# EAGLE design light_brick (EAGLE 7.2.0)
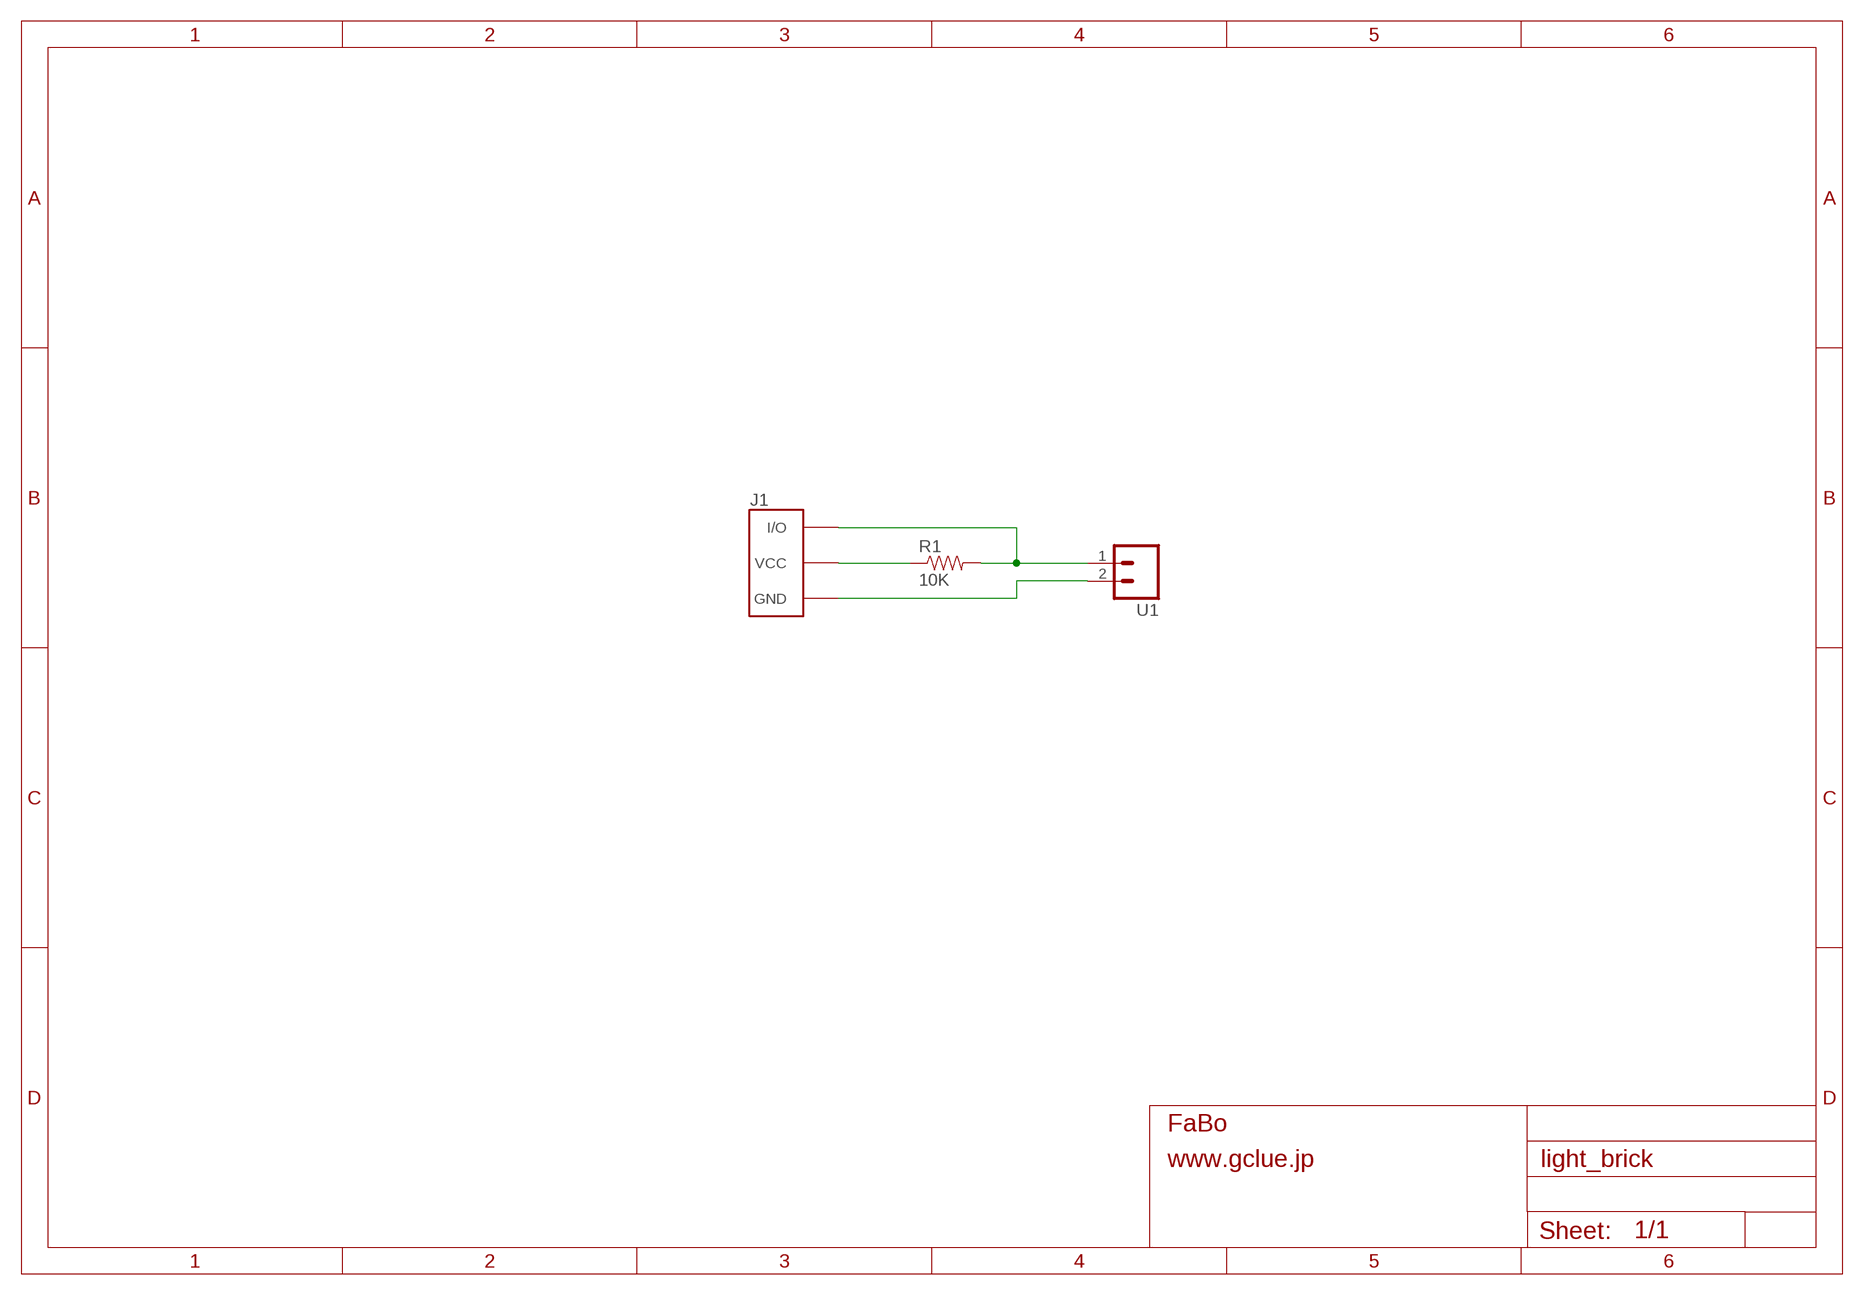
[diagram p0: schematic, sheet 1]

## Parts
J1  BRICK_3PIN  [BRICK_3PIN]
R1  10K  RESISTORAXIAL-0.3  [AXIAL-0.3]
U1  M02NG  [1X02]

## Nets
GND: J1.GND U1.2
N$1: J1.VCC R1.P$1
N$2: J1.IN/OUT(I/O) R1.P$2 U1.1

## Library data of the parts
J1 = Gclue:BRICK_3PIN: FaBo Brick 3pin
R1 = SparkFun:RESISTOR: Resistor Basic schematic elements and footprints for 0603, 1206, and PTH resistors.
U1 = SparkFun:M02NG

## Board
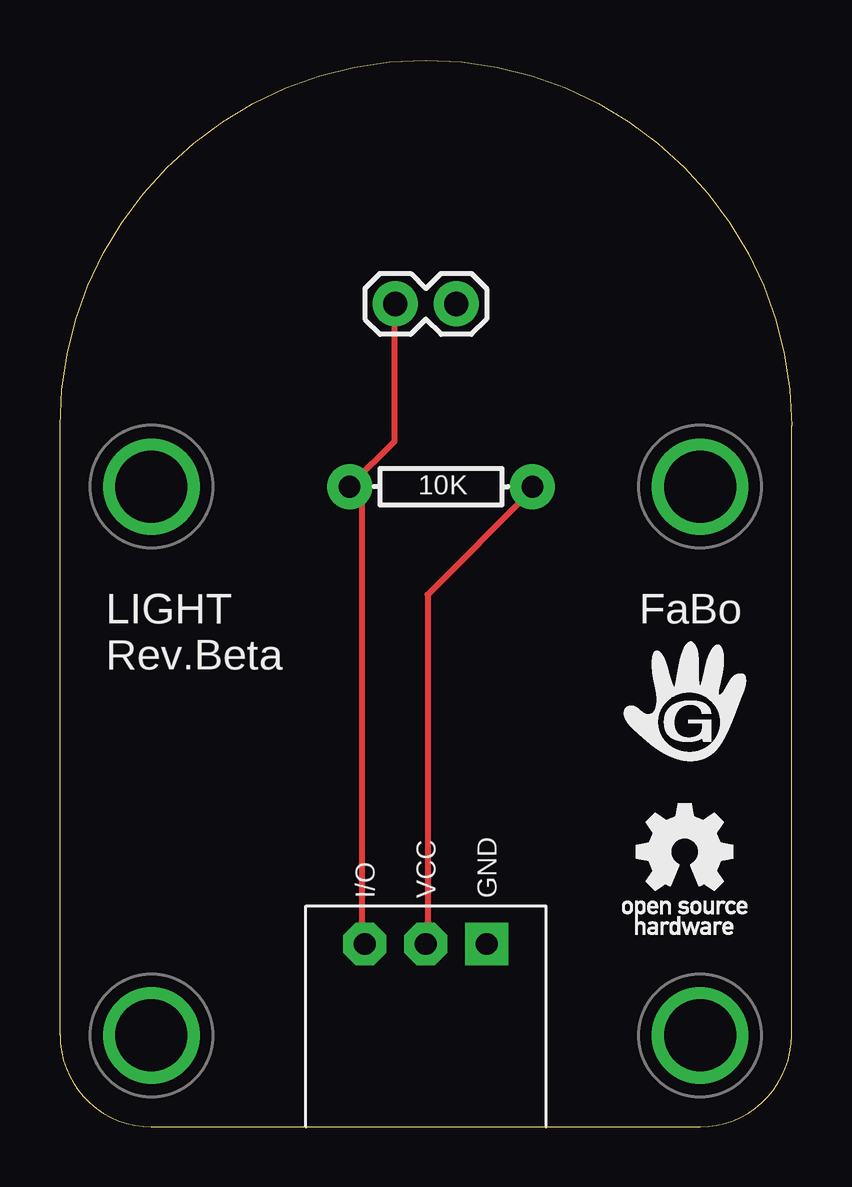
[diagram p1: board, top side]
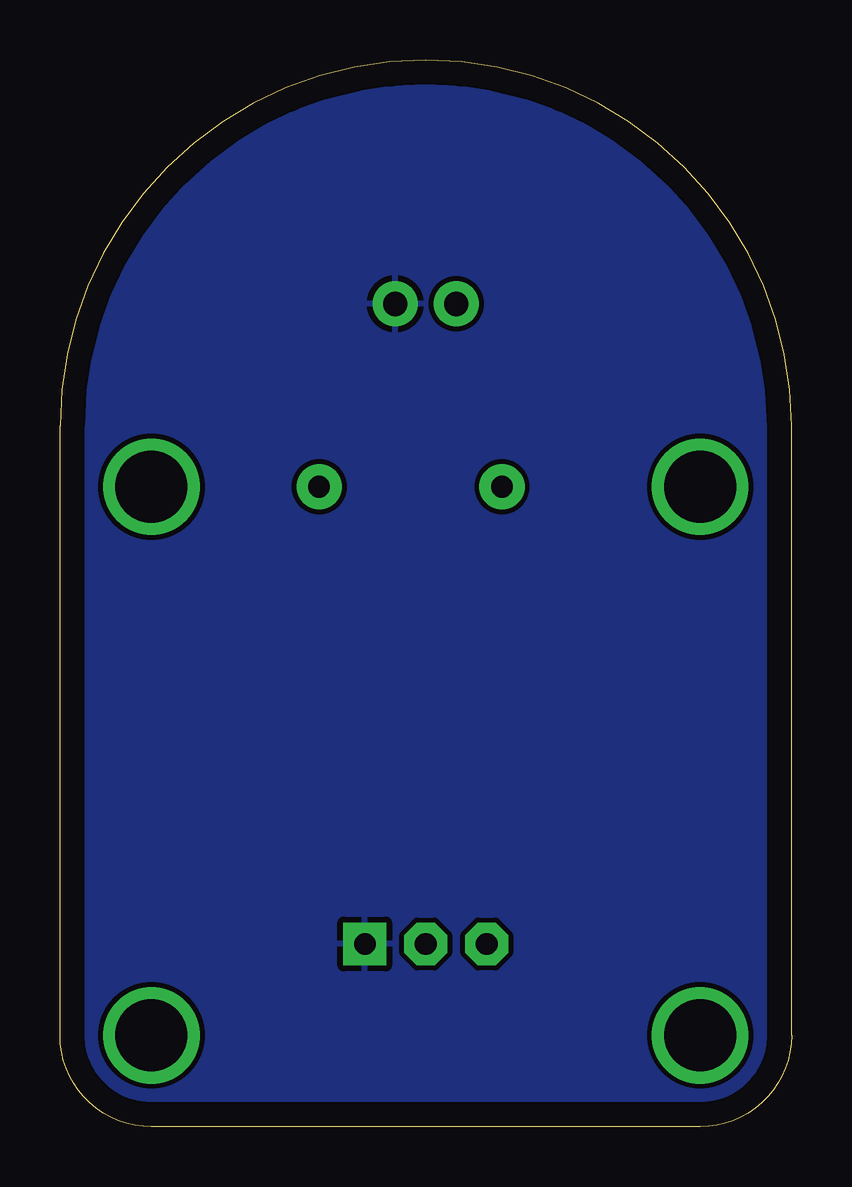
[diagram p2: board, bottom side, seen from below]

Size 30.48 x 44.45 mm. Coordinates in mm from the lower left corner, seen from the top.
Copper layers (1*16): Top 0.035mm / dielectric 1.5mm / Bottom 0.035mm
Design rules "default": minimum track width 10mil, minimum drill 24mil, track to track 8mil, track to pad 8mil, pad to pad 8mil, via to via 8mil, smd to smd 8mil, copper to edge 40mil, drill to drill 8mil, minimum pad ring 10mil, minimum via ring 8mil, stop-mask expansion 4mil, vias tented up to drill 0mil, thermal gap 10mil

### Footprints (pad centres in the part's own frame; a part is rotated, then mirrored left to right if it is on the bottom)
BRICK_3PIN = drill 0.9 pad 1.778 square: GND 2.54,-11.43 | drill 0.9 pad 1.778 octagon: IN/OUT -2.54,-11.43; VCC 0,-11.43 | drill 3 pad 3.81: P$1 -11.43,7.62; P$2 11.43,7.62; P$3 11.43,-15.24; P$4 -11.43,-15.24
AXIAL-0.3 = drill 0.9 pad 1.88: P$1 -3.81,0; P$2 3.81,0
1X02 = drill 1.016 pad 1.88: 1 0,0; 2 2.54,0

### Placement (x,y rotation side)
J1  15.24,19.05 0 top
R1  15.88,26.67 180 top
U1  13.97,34.29 0 top
U$2  [LOGO_GCLUE_M]  26.04,17.78 0 top
U$3  [LOGO_OSHW_T_M]  26.04,11.43 0 top

### Tracks (layer width: path | path; a pad name or v marks a point on that pad's centre or on a via)
GND
  pour Bottom: 0,0 30.48,0 30.48,44.45 0,44.45
N$1
  Top 0.254: J1.VCC 15.32,7.77 15.32,22.17 19.66,26.52 R1.P$1
N$2
  Top 0.254: J1.IN/OUT 12.57,7.77 12.57,26.06 12.12,26.52 R1.P$2 12.12,26.75 13.95,28.57 13.95,34.29 U1.1

### Text on the board
tPlace: FaBo | LIGHT / Rev.Beta